# EAGLE design pyro18 (EAGLE 7.6.0)
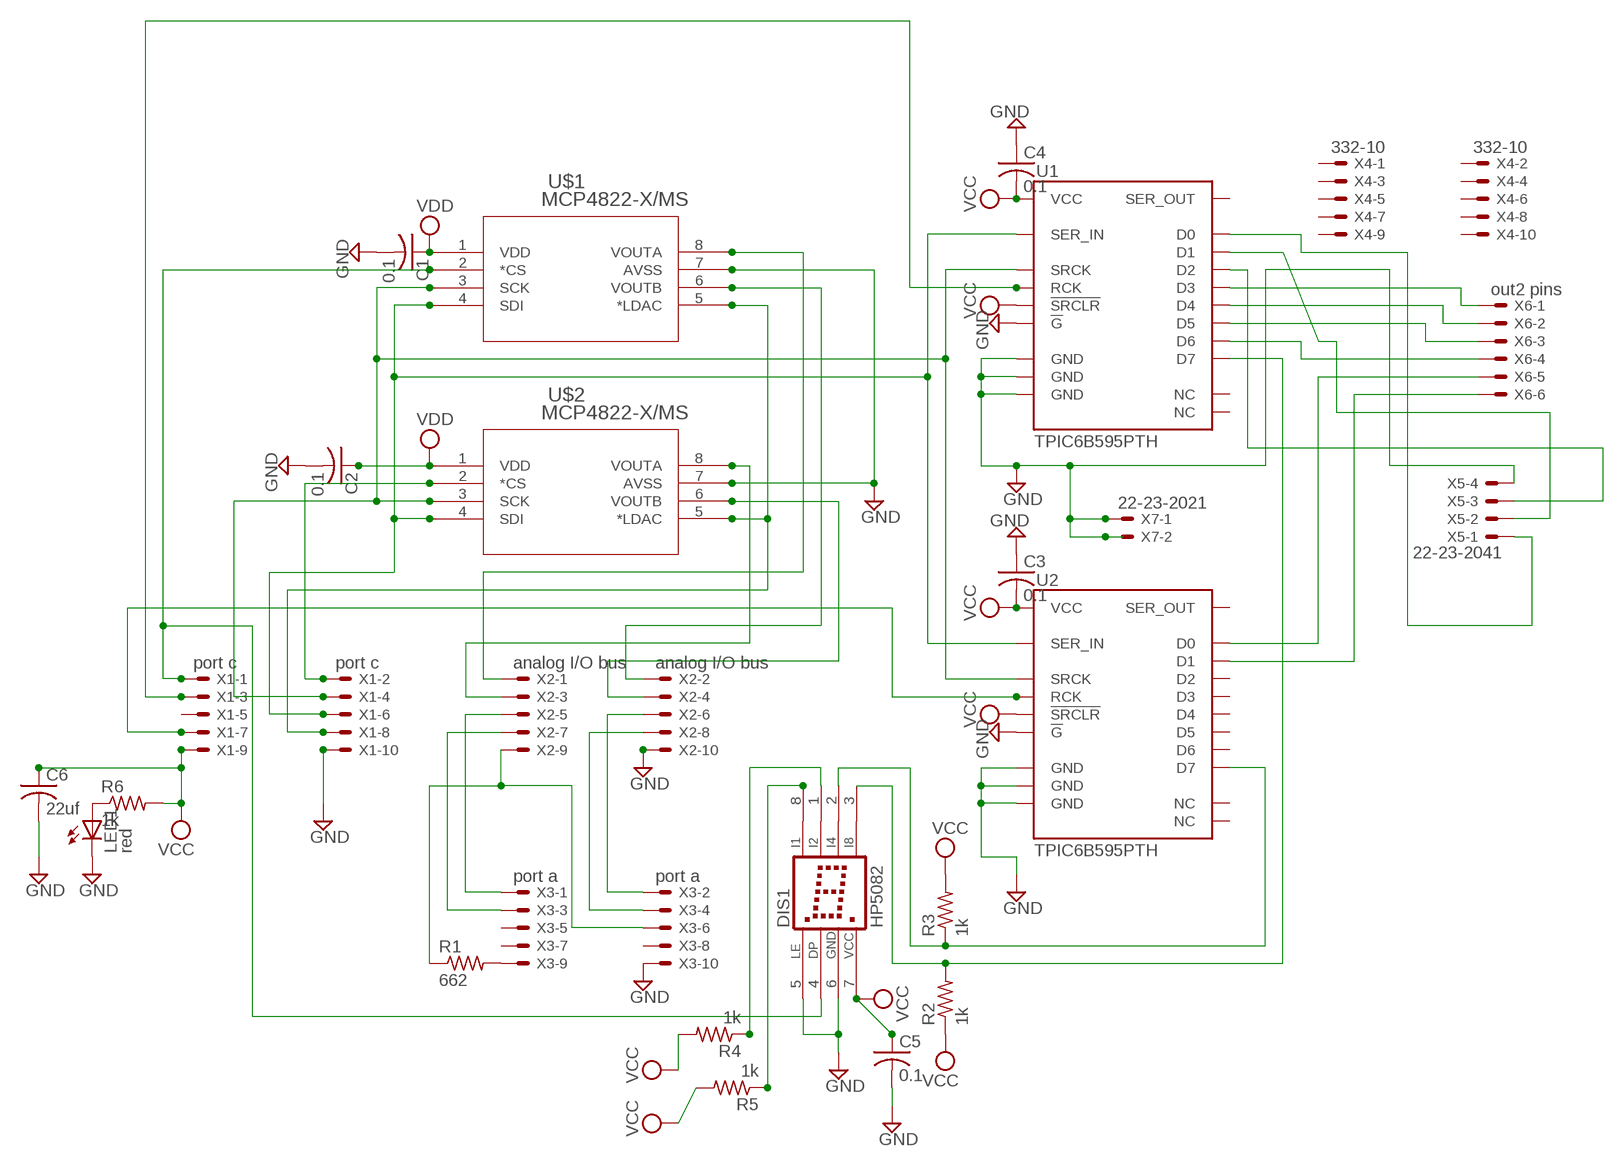
[diagram p0: schematic, sheet 1]

## Parts
C1  0.1  C-USC0805  [C0805]
C2  0.1  C-USC0805  [C0805]
C3  0.1  C-USC0805  [C0805]
C4  0.1  C-USC0805  [C0805]
C5  0.1  C-USC0805  [C0805]
C6  22uf  C-USC0805  [C0805]
DIS1  HP5082  [HP5082]
LED1  red  LED3MM  [LED3MM]
R1  662  R-US_0207/2V  [0207/2V]
R2  1k  R-US_0207/2V  [0207/2V]
R3  1k  R-US_0207/2V  [0207/2V]
R4  1k  R-US_0207/2V  [0207/2V]
R5  1k  R-US_0207/2V  [0207/2V]
R6  1k  R-US_0207/2V  [0207/2V]
U1  TPIC6B595PTH  [DIL20]
U2  TPIC6B595PTH  [DIL20]
U$1  MCP4822-X/MS  [MSOP8_MC]
U$2  MCP4822-X/MS  [MSOP8_MC]
X1  port c  332-10  [332-10]
X2  analog I/O bus  332-10  [332-10]
X3  port a  332-10  [332-10]
X4  332-10  [332-10]
X5  22-23-2041  [22-23-2041]
X6  out2 pins  22-23-2061  [22-23-2061]
X7  22-23-2021  [22-23-2021]

## Nets
GND: C1.2 C2.2 C3.1 C4.1 C5.2 C6.2 DIS1.5(LE) DIS1.6(GND) LED1.K(C) U1.9(!G) U1.10(GND) U1.11(GND) U1.19(GND) U2.9(!G) U2.10(GND) U2.11(GND) U2.19(GND) U$1.7(AVSS) U$2.7(AVSS) X1.10 X2.10 X3.10 X5.4 X7.1 X7.2
N$1: DIS1.4(DP) U$1.2(*CS) X1.1
N$2: U$2.2(*CS) X1.2
N$3: U$1.5(*LDAC) U$2.5(*LDAC) X1.8
N$4: U$1.8(VOUTA) X2.1
N$7: U1.13(SRCK) U2.13(SRCK) U$1.3(SCK) U$2.3(SCK) X1.4
N$8: U1.4(D0) X5.1
N$10: U$1.6(VOUTB) X2.2
N$12: U1.3(SER_IN) U2.3(SER_IN) U$1.4(SDI) U$2.4(SDI) X1.6
N$13: U$2.8(VOUTA) X2.3
N$14: U1.12(RCK) X1.3
N$15: U2.12(RCK) X1.7
N$16: U$2.6(VOUTB) X2.4
N$17: X2.5 X3.1
N$18: X2.6 X3.2
N$19: X2.7 X3.3
N$20: X2.8 X3.4
N$21: R1.1 X2.9 X3.6
N$22: R1.2 X3.9
N$23: DIS1.2(I4) R3.1 U2.17(D7)
N$24: DIS1.3(I8) R2.2 U1.17(D7)
N$25: U1.5(D1) X5.2
N$26: DIS1.8(I1) R5.1
N$27: DIS1.1(I2) R4.1
N$28: U1.6(D2) X5.3
N$29: U1.14(D4) X6.2
N$30: U1.7(D3) X6.1
N$31: U1.15(D5) X6.3
N$32: U1.16(D6) X6.4
N$33: U2.4(D0) X6.5
N$34: U2.5(D1) X6.6
N$35: LED1.A R6.1
VCC: C3.2 C4.2 C5.1 C6.1 DIS1.7(VCC) R2.1 R3.2 R4.2 R5.2 R6.2 U1.2(VCC) U1.8(!SRCLR) U2.2(VCC) U2.8(!SRCLR) X1.9
VDD: C1.1 C2.1 U$1.1(VDD) U$2.1(VDD)
Unconnected: U1.1(NC) U1.18(SER_OUT) U1.20(NC) U2.1(NC) U2.6(D2) U2.7(D3) U2.14(D4) U2.15(D5) U2.16(D6) U2.18(SER_OUT) U2.20(NC) X1.5 X3.5 X3.7 X3.8 X4.1 X4.2 X4.3 X4.4 X4.5 X4.6 X4.7 X4.8 X4.9 X4.10

## Library data of the parts
C1-C6 = rcl:C-US: CAPACITOR, American symbol
DIS1 = display-hp:HP5082: LED DISPLAY 1-character dot matrix, 2 decimal points; OC_FARNELL: unknown; OC_NEWARK: unknown
LED1 = led:LED: LED OSRAM: - CHIPLED LG R971, LG N971, LY N971, LG Q971, LY Q971, LO R971, LY R971 LH N974, LH R974 LS Q976, LO Q976, LY Q976 LO Q996 - Hyper CHIPLED LW Q18S LB Q993, LB Q99A, LB R99A - SideLED LS A670, LO A670, LY A670, LG A670, LP A670 LB A673, LV A673, LT A673, LW A673 LH A674 LY A675 LS A676, LA A676, LO A676, LY A676, LW A676 LS A679, LY A679, LG A679 - Hyper Micro SIDELED® LS Y876, LA Y876, LO Y876, LY Y876 LT Y87S - SmartLED LW L88C, LW L88S LB L89C, LB L89S, LG L890 LS L89K, LO L89K, LY L89K LS L896, LA L896, LO L896, LY L896 - TOPLED LS T670, LO T670, LY T670, LG T670, LP T670 LSG T670, LSP T670, LSY T670, LOP T670, LYG T670 LG T671, LOG T671, LSG T671 LB T673, LV T673, LT T673, LW T673 LH T674 LS T676, LA T676, LO T676, LY T676, LB T676, LH T676, LSB T676, LW T676 LB T67C, LV T67C, LT T67C, LS T67K, LO T67K, LY T67K, LW E67C LS E67B, LA E67B, LO E67B, LY E67B, LB E67C, LV E67C, LT E67C LW T67C LS T679, LY T679, LG T679 LS T770, LO T770, LY T770, LG T770, LP T770 LB T773, LV T773, LT T773, LW T773 LH T774 LS E675, LA E675, LY E675, LS T675 LS T776, LA T776, LO T776, LY T776, LB T776 LHGB T686 LT T68C, LB T68C - Hyper Mini TOPLED® LB M676 - Mini TOPLED Santana® LG M470 LS M47K, LO M47K, LY M47K Source: http://www.osram.convergy.de LUXEON: - LUMILED® LXK2-PW12-R00, LXK2-PW12-S00, LXK2-PW14-U00, LXK2-PW14-V00 LXK2-PM12-R00, LXK2-PM12-S00, LXK2-PM14-U00 LXK2-PE12-Q00, LXK2-PE12-R00, LXK2-PE12-S00, LXK2-PE14-T00, LXK2-PE14-U00 LXK2-PB12-K00, LXK2-PB12-L00, LXK2-PB12-M00, LXK2-PB14-N00, LXK2-PB14-P00, LXK2-PB14-Q00 LXK2-PR12-L00, LXK2-PR12-M00, LXK2-PR14-Q00, LXK2-PR14-R00 LXK2-PD12-Q00, LXK2-PD12-R00, LXK2-PD12-S00 LXK2-PH12-R00, LXK2-PH12-S00 LXK2-PL12-P00, LXK2-PL12-Q00, LXK2-PL12-R00 Source: www.luxeon.com KINGBRIGHT: KA-3528ASYC Source: www.kingbright.com
R1-R6 = resistor:R-US_: RESISTOR, American symbol
U1 U2 = SparkFun-DigitalIC:TPIC6B595
U$1 U$2 = mcp4822:MCP4822-X/MS
X1-X4 = con-garry:332-10: 10 Pin - 2mm Dual Row Source: www.mpe-connector.de / garry_shortform_2012.pdf
X5 = con-molex:22-23-2041: .100" (2.54mm) Center Header - 4 Pin; MF: MOLEX; MPN: 22-23-2041; OC_FARNELL: 1462920; OC_NEWARK: 38C0355
X6 = con-molex:22-23-2061: .100" (2.54mm) Center Header - 6 Pin; MF: MOLEX; MPN: 22-23-2061; OC_FARNELL: 1462922; OC_NEWARK: 27C1933
X7 = con-molex:22-23-2021: .100" (2.54mm) Center Header - 2 Pin; MF: MOLEX; MPN: 22-23-2021; OC_FARNELL: 1462926; OC_NEWARK: 25C3832

## Board
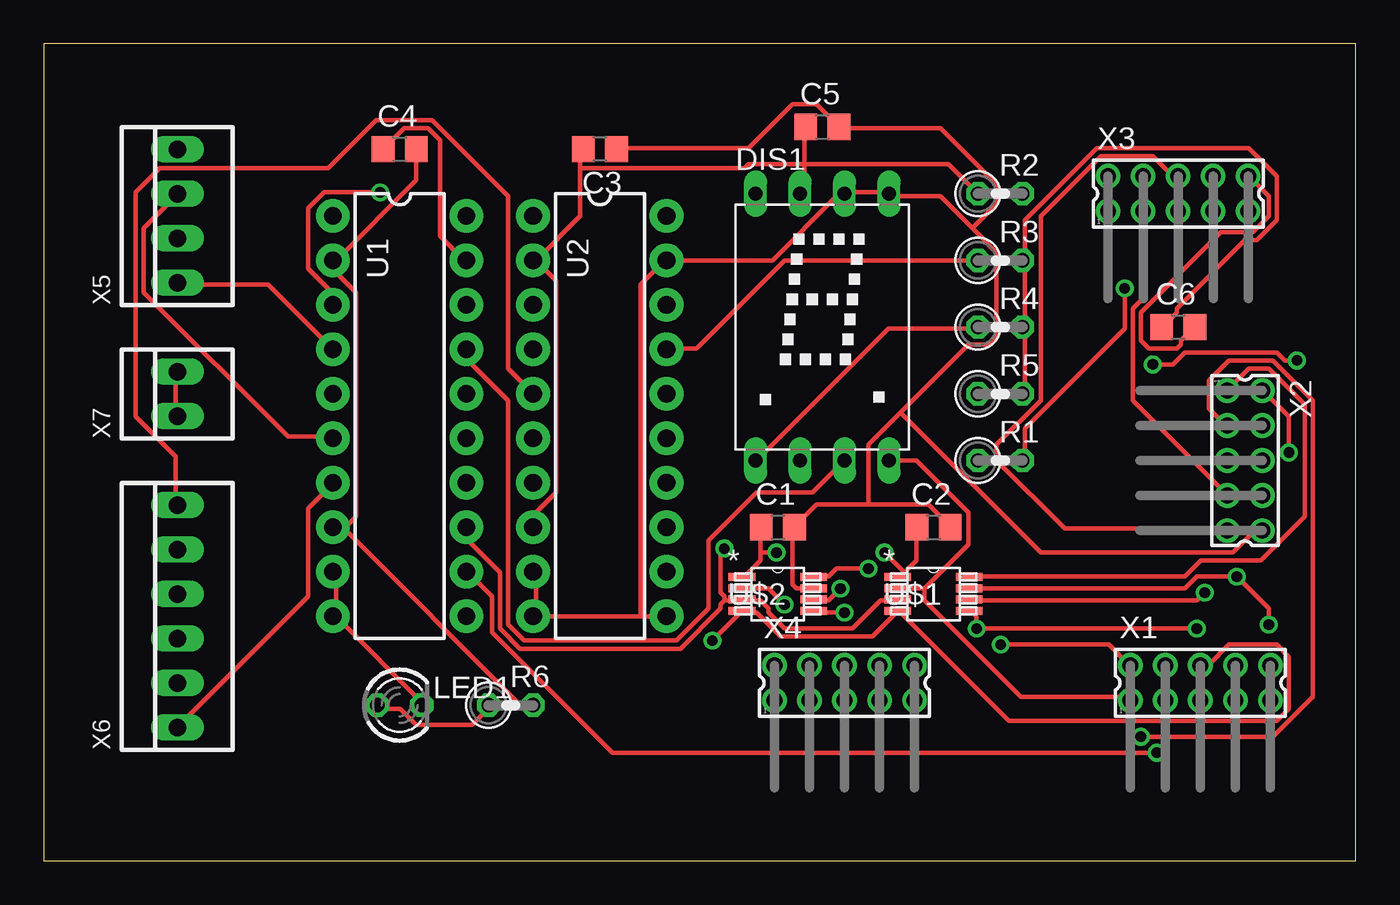
[diagram p1: board, top side]
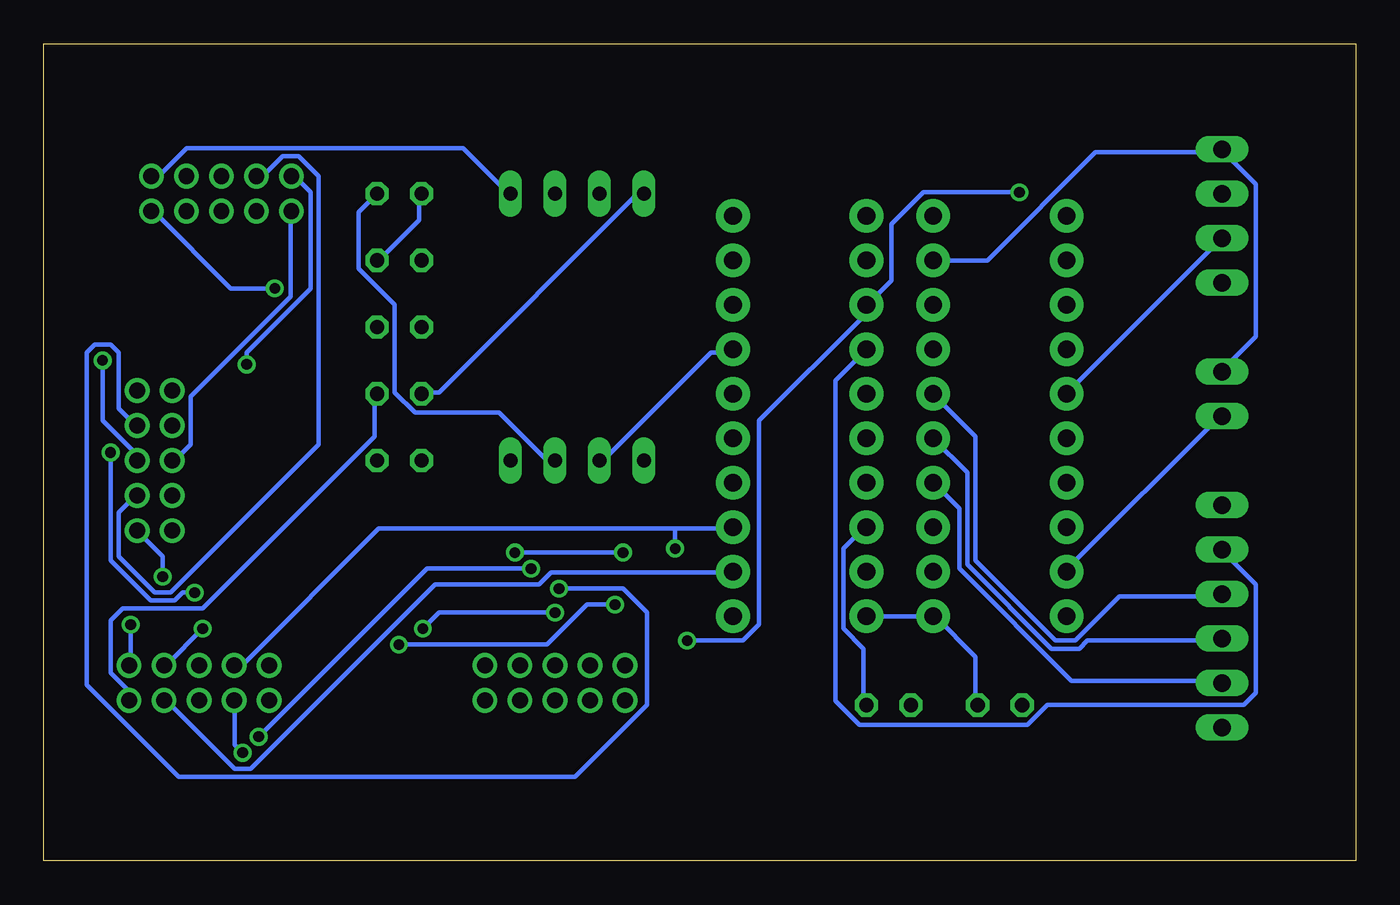
[diagram p2: board, bottom side, seen from below]

Size 74.91 x 46.66 mm. Coordinates in mm from the lower left corner, seen from the top.
Outline: 0,0 74.91,0 74.91,46.66 0,46.66 0,0
Copper layers (1*16): Top 0.035mm / dielectric 1.5mm / Bottom 0.035mm
Design rules "default *": minimum track width 10mil, minimum drill 24mil, track to track 8mil, track to pad 8mil, pad to pad 8mil, via to via 8mil, smd to smd 8mil, copper to edge 40mil, drill to drill 8mil, minimum pad ring 10mil, minimum via ring 8mil, stop-mask expansion 4mil, vias tented up to drill 0mil, thermal gap 10mil

### Footprints (pad centres in the part's own frame; a part is rotated, then mirrored left to right if it is on the bottom)
C0805 = smd 1.3 x 1.5: 1 -0.95,0; 2 0.95,0
HP5082 = drill 0.813 long: 1 -3.81,-7.62; 2 -1.27,-7.62; 3 1.27,-7.62; 4 3.81,-7.62; 5 3.81,7.62; 6 1.27,7.62; 7 -1.27,7.62; 8 -3.81,7.62
LED3MM = drill 0.813 octagon: A -1.27,0; K 1.27,0
0207/2V = drill 0.813 octagon: 1 -1.27,0; 2 1.27,0
DIL20 = drill 1.016 pad 1.93: 1 -11.43,-3.81; 2 -8.89,-3.81; 3 -6.35,-3.81; 4 -3.81,-3.81; 5 -1.27,-3.81; 6 1.27,-3.81; 7 3.81,-3.81; 8 6.35,-3.81; 9 8.89,-3.81; 10 11.43,-3.81; 11 11.43,3.81; 12 8.89,3.81; 13 6.35,3.81; 14 3.81,3.81; 15 1.27,3.81; 16 -1.27,3.81; 17 -3.81,3.81; 18 -6.35,3.81; 19 -8.89,3.81; 20 -11.43,3.81
MSOP8_MC = smd 1.524 x 0.457: 1 -2.044,0.975; 2 -2.044,0.325; 3 -2.044,-0.325; 4 -2.044,-0.975; 5 2.044,-0.975; 6 2.044,-0.325; 7 2.044,0.325; 8 2.044,0.975
332-10 = drill 0.9 pad 1.27: 1 -4,-1; 2 -4,1; 3 -2,-1; 4 -2,1; 5 0,-1; 6 0,1; 7 2,-1; 8 2,1; 9 4,-1; 10 4,1
22-23-2041 = drill 1 long: 1 -3.81,0; 2 -1.27,0; 3 1.27,0; 4 3.81,0
22-23-2061 = drill 1 long: 1 -6.35,0; 2 -3.81,0; 3 -1.27,0; 4 1.27,0; 5 3.81,0; 6 6.35,0
22-23-2021 = drill 1 long: 1 -1.27,0; 2 1.27,0

### Placement (x,y rotation side)
C1  41.91,19.05 0 top
C2  50.8,19.05 0 top
C3  31.75,40.64 180 top
C4  20.32,40.64 0 top
C5  44.45,41.91 0 top
C6  64.77,30.48 0 top
DIS1  44.45,30.48 0 top
LED1  20.32,8.89 0 top
R1  54.61,22.86 0 top
R2  54.61,38.1 0 top
R3  54.61,34.29 0 top
R4  54.61,30.48 0 top
R5  54.61,26.67 0 top
R6  26.67,8.89 0 top
U1  20.32,25.4 270 top
U2  31.75,25.4 270 top
U$1  50.8,15.24 0 top
U$2  41.91,15.24 0 top
X1  66.04,10.16 0 top
X2  68.58,22.86 270 top
X3  64.77,38.1 0 top
X4  45.72,10.16 0 top
X5  7.62,36.83 90 top
X6  7.62,13.97 90 top
X7  7.62,26.67 90 top

### Tracks (layer width: path | path; a pad name or v marks a point on that pad's centre or on a via)
GND  (via drill 0.61)
  Top 0.254: U2.9 28.12,16.46 28.12,14.17 U2.10 28.12,13.95 34.06,13.95 | 34.06,13.95 35.43,13.95 U2.11 | U1.9 16.69,16.46 16.69,14.17 U1.10 16.69,13.95 21.72,8.91 LED1.K | C4.1 19.43,40.69 20.57,41.83 21.95,41.83 22.63,41.15 22.63,35.66 24,34.29 U1.19 | X7.1 7.54,25.6 7.54,27.89 X7.2 | U$1.7 53.03,15.55 65.15,15.55 65.84,16.23 v68.12,16.23 69.95,14.4 v69.95,13.49 | C6.2 65.61,30.4 64.92,29.72 64.92,29.49 64.69,29.26 63.09,29.26 62.64,29.72 62.64,31.32 67.21,35.89 69.04,35.89 69.95,36.81 69.95,37.95 68.81,39.09 X3.10 | C3.1 32.92,40.69 40.23,40.69 42.75,43.2 44.12,43.2 45.26,42.06 C5.2 45.49,41.83 51.21,41.83 54.41,38.63 54.41,37.49 53.03,36.12 | U$2.7 43.89,15.55 42.98,15.55 42.75,15.77 42.75,18.97 C1.2 42.98,19.2 44.12,20.34 47.09,20.34 | 47.09,20.34 50.52,20.34 51.66,19.2 C2.2 | 47.09,20.34 47.09,23.77 48.92,25.6 | 48.92,25.6 52.81,29.49 53.95,29.49 54.41,29.95 54.41,34.75 53.03,36.12 | 53.03,36.12 51.21,37.95 48.46,37.95 DIS1.5 48.23,38.18 45.72,38.18 DIS1.6 45.72,37.95 45.26,37.95 41.6,34.29 U2.19 35.43,34.29 34.06,32.92 34.06,13.95 | 48.92,25.6 56.92,17.6 67.89,17.6 69.04,18.75 69.49,18.75 X2.10
  Bottom 0.254: LED1.K 21.72,8.91 21.72,11.66 24,13.95 U1.11 24.23,13.95 27.89,13.95 U2.10 | X7.2 7.54,28.12 5.71,29.95 5.71,38.63 7.54,40.46 X5.4 7.77,40.46 14.86,40.46 21.03,34.29 U1.19 | U1.9 16.46,16.69 7.77,25.38 X7.1 | v68.12,16.23 68.12,17.37 69.49,18.75 X2.10 | v69.95,13.49 69.95,11.2 X1.10 | X3.10 68.58,39.32 68.12,39.32 66.75,40.69 50.98,40.69 48.46,38.18 DIS1.5
N$1
  Top 0.254: 50.29,15.55 48.92,15.55 U$1.2 | 50.29,15.55 52.81,18.06 52.81,19.89 49.84,22.86 DIS1.4 | 50.29,15.55 50.29,14.86 55.78,9.37 61.95,9.37 X1.1
N$2  (via drill 0.61)
  Top 0.254: v42.29,14.63 41.38,15.55 40.01,15.55 U$2.2 | v54.63,12.34 60.81,12.34 61.95,11.2 X1.2
  Bottom 0.254: v42.29,14.63 43.89,14.63 46.18,12.34 v54.63,12.34
N$3  (via drill 0.61)
  Top 0.254: v45.72,14.17 44.12,14.17 U$2.5 | U$1.5 53.03,14.17 53.26,13.95 v53.26,13.26 v65.84,13.26
  Bottom 0.254: v45.72,14.17 52.35,14.17 v53.26,13.26 | v65.84,13.26 67.89,11.2 X1.8
N$4
  Top 0.254: U$1.8 53.03,16.23 65.15,16.23 66.06,17.15 69.49,17.15 72.01,19.66 72.01,26.06 69.95,28.12 68.81,28.12 67.67,26.97 X2.1
N$7  (via drill 0.61)
  Top 0.254: U$1.3 48.69,14.86 47.78,14.86 46.18,13.26 42.29,13.26 41.38,14.17 41.38,14.4 40.92,14.86 40.01,14.86 U$2.3 39.78,14.86 38.86,14.86 | 38.86,14.86 38.63,14.63 38.63,14.4 36.35,12.12 27.2,12.12 26.06,13.26 26.06,16.46 24.23,18.29 24.23,18.97 U1.13 | 38.86,14.86 38.86,15.09 38.63,15.32 38.63,17.6 v38.86,17.83
  Bottom 0.254: 38.86,18.97 35.66,18.97 U2.13 | 38.86,18.97 55.78,18.97 63.55,11.2 64.01,11.2 X1.4 | 38.86,18.97 v38.86,17.83
N$8
  Top 0.254: U1.4 12.8,32.92 7.77,32.92 X5.1
N$10  (via drill 0.61)
  Top 0.254: v66.29,15.32 65.84,14.86 53.03,14.86 U$1.6 | v71.09,23.32 71.09,25.38 69.72,26.75 X2.2
  Bottom 0.254: v66.29,15.32 66.98,15.32 67.44,14.86 68.81,14.86 71.09,17.15 v71.09,23.32
N$12  (via drill 0.61)
  Top 0.254: v19.2,38.18 16,38.18 15.09,37.26 15.09,33.83 16.46,32.46 16.46,31.78 U1.3 | X1.6 66.06,11.2 66.52,11.2 67.67,12.34 70.41,12.34 71.09,11.66 71.09,8.69 70.41,8 55.09,8 48.92,14.17 U$1.4 48.69,14.17 47.32,12.8 42.06,12.8 40.69,14.17 40.01,14.17 U$2.4 39.78,14.17 v38.18,12.57
  Bottom 0.254: v19.2,38.18 24.69,38.18 26.52,36.35 26.52,33.15 27.89,31.78 U2.3 28.12,31.55 28.12,31.09 34.06,25.15 34.06,13.49 34.98,12.57 v38.18,12.57
N$13  (via drill 0.61)
  Top 0.254: v47.09,16.69 45.26,16.69 44.81,16.23 44.12,16.23 U$2.8 | v62.64,7.09 70.18,7.09 72.47,9.37 72.47,26.29 70.18,28.58 67.67,28.58 66.52,27.43 66.52,25.83 67.44,24.92 X2.3
  Bottom 0.254: v47.09,16.69 53.03,16.69 v62.64,7.09
N$14  (via drill 0.61)
  Top 0.254: v63.55,6.17 32.46,6.17 25.6,13.03 25.6,15.09 24.23,16.46 U1.12
  Bottom 0.254: v63.55,6.17 64.01,6.63 64.01,9.14 X1.3
N$15
  Bottom 0.254: X1.7 67.89,9.14 64.01,5.26 63.09,5.26 52.58,15.77 46.63,15.77 45.95,16.46 35.66,16.46 U2.12
N$16  (via drill 0.61)
  Top 0.254: v45.49,15.55 44.81,14.86 44.12,14.86 U$2.6
  Bottom 0.254: v45.49,15.55 41.83,15.55 40.46,14.17 40.46,8.91 44.58,4.8 67.21,4.8 72.47,10.06 72.47,29.03 72.01,29.49 71.09,29.49 70.64,29.03 70.64,25.83 69.72,24.92 X2.4
N$17
  Bottom 0.254: X3.1 60.81,37.03 60.81,32.23 66.52,26.52 66.52,23.77 67.44,22.86 X2.5
N$18  (via drill 0.61)
  Top 0.254: v71.55,28.58 70.87,28.58 70.41,29.03 65.15,29.03 64.47,28.35 v63.32,28.35
  Bottom 0.254: v71.55,28.58 71.55,25.15 69.72,23.32 69.72,22.86 X2.6 | v63.32,28.35 63.32,29.03 59.66,32.69 59.66,38.18 60.58,39.09 X3.2
N$19
  Top 0.254: X3.3 62.64,37.03 62.64,32 62.18,31.55 62.18,26.29 67.44,21.03 X2.7
N$20
  Bottom 0.254: X3.4 62.64,39.32 62.18,39.32 61.27,40.23 60.35,40.23 59.21,39.09 59.21,23.77 67.67,15.32 68.58,15.32 70.64,17.37 70.64,19.89 69.72,20.8 X2.8
N$21
  Top 0.254: 54.41,22.86 R1.1 | 54.41,22.86 58.29,18.97 67.44,18.97 X2.9 | 54.41,22.86 54.41,23.77 56.92,26.29 56.92,36.81 60.35,40.23 63.32,40.23 64.24,39.32 64.69,39.32 X3.6
N$22  (via drill 0.61)
  Top 0.254: v61.72,32.69 61.72,30.4 56.01,24.69 56.01,22.86 R1.2
  Bottom 0.254: v61.72,32.69 64.24,32.69 68.58,37.03 X3.9
N$23
  Top 0.254: R3.1 42.29,34.29 37.26,29.26 35.66,29.26 U2.17
  Bottom 0.254: DIS1.2 42.98,22.86 36.8,29.03 35.66,29.03 U2.17
N$24
  Top 0.254: DIS1.3 43.89,21.03 40.69,21.03 37.95,18.29 37.95,14.4 36.12,12.57 27.43,12.57 26.52,13.49 26.52,26.29 24.23,28.58 24.23,29.03 U1.17
  Bottom 0.254: DIS1.3 46.18,22.86 48.92,25.6 53.72,25.6 54.86,26.75 54.86,31.78 56.92,33.83 56.92,37.03 56.01,37.95 R2.2
N$25
  Bottom 0.254: X5.2 7.77,35.43 16.46,26.75 U1.5
N$26
  Bottom 0.254: DIS1.8 40.69,37.95 41.15,37.95 52.35,26.75 53.26,26.75 R5.1
N$27
  Top 0.254: DIS1.1 40.69,22.86 48.23,30.4 53.26,30.4 R4.1
N$28
  Top 0.254: X5.3 7.54,37.95 5.71,36.12 5.71,32.46 13.95,24.23 16.46,24.23 U1.6
N$29
  Bottom 0.254: X6.2 7.77,10.29 16.23,10.29 22.63,16.69 22.63,20.12 24,21.49 U1.14
N$30
  Top 0.254: X6.1 15.09,15.09 15.09,20.12 16.46,21.49 U1.7
N$31
  Bottom 0.254: U1.15 22.17,22.17 22.17,16.92 17.37,12.12 15.77,12.12 15.32,12.57 7.77,12.57 X6.3
N$32
  Bottom 0.254: X6.4 7.77,15.09 13.49,15.09 16,12.57 17.14,12.57 21.72,17.15 21.72,24.23 24,26.52 U1.16
N$33
  Bottom 0.254: U2.4 29.72,27.43 29.72,9.14 28.35,7.77 18.75,7.77 17.6,8.91 6.4,8.91 5.71,9.6 5.71,15.77 7.54,17.6 X6.5
N$34
  Top 0.254: X6.6 7.54,20.34 7.54,23.09 5.26,25.38 5.26,38.18 6.63,39.55 16.23,39.55 18.97,42.29 22.17,42.29 26.52,37.95 26.52,28.12 27.89,26.75 U2.5
N$35
  Top 0.254: LED1.A 19.2,8.69 20.34,8.69 21.26,7.77 24.46,7.77 25.38,8.69 R6.1
VCC
  Top 0.254: 16.69,34.29 21.26,38.86 21.26,40.46 C4.2 | 17.14,18.97 16.69,18.97 U1.8 17.14,18.97 | 17.14,18.97 27.2,8.91 27.89,8.91 R6.2 | 16.69,34.29 16.69,33.6 17.83,32.46 17.83,19.66 17.14,18.97 | 16.69,34.29 U1.2 | R5.2 56.01,26.75 56.01,30.4 R4.2 56.01,30.63 56.01,34.29 | 30.63,39.55 30.63,36.81 28.12,34.29 | 30.63,39.55 30.63,40.46 C3.2 | 43.66,41.83 C5.1 43.43,41.83 43.43,39.78 | 43.43,39.78 43.43,38.41 43.2,38.18 DIS1.7 | 64.01,30.4 C6.1 64.01,30.63 64.69,31.32 64.69,31.55 68.58,35.43 69.27,35.43 70.41,36.58 70.41,39.09 68.81,40.69 60.12,40.69 56.01,36.58 56.01,34.29 | 43.43,39.78 51.66,39.78 R2.1 | 30.63,39.55 40.01,39.55 40.23,39.78 43.43,39.78 | 56.01,34.29 R3.2 | 28.12,34.29 29.26,33.15 29.26,21.03 28.12,19.89 28.12,19.2 U2.8 | 28.12,34.29 U2.2
  Bottom 0.254: R6.2 28.12,8.91 28.12,12.12 29.26,13.26 29.26,17.83 28.12,18.97 U2.8 | X1.9 70.18,9.37 70.18,9.83 71.09,10.74 71.09,13.72 70.41,14.4 65.84,14.4 56.01,24.23 56.01,26.52 R5.2 | R2.1 53.49,37.95 53.49,36.58 55.78,34.29 R3.2
VDD  (via drill 0.61)
  Top 0.254: 40.92,17.6 40.92,17.15 40.01,16.23 U$2.1 | 40.92,17.6 40.92,18.97 C1.1 | 49.15,16.46 48.92,16.23 U$1.1 | 49.15,16.46 49.84,17.15 49.84,18.97 C2.1 | v41.83,17.6 40.92,17.6 | 49.15,16.46 v48.01,17.6
  Bottom 0.254: v48.01,17.6 v41.83,17.6